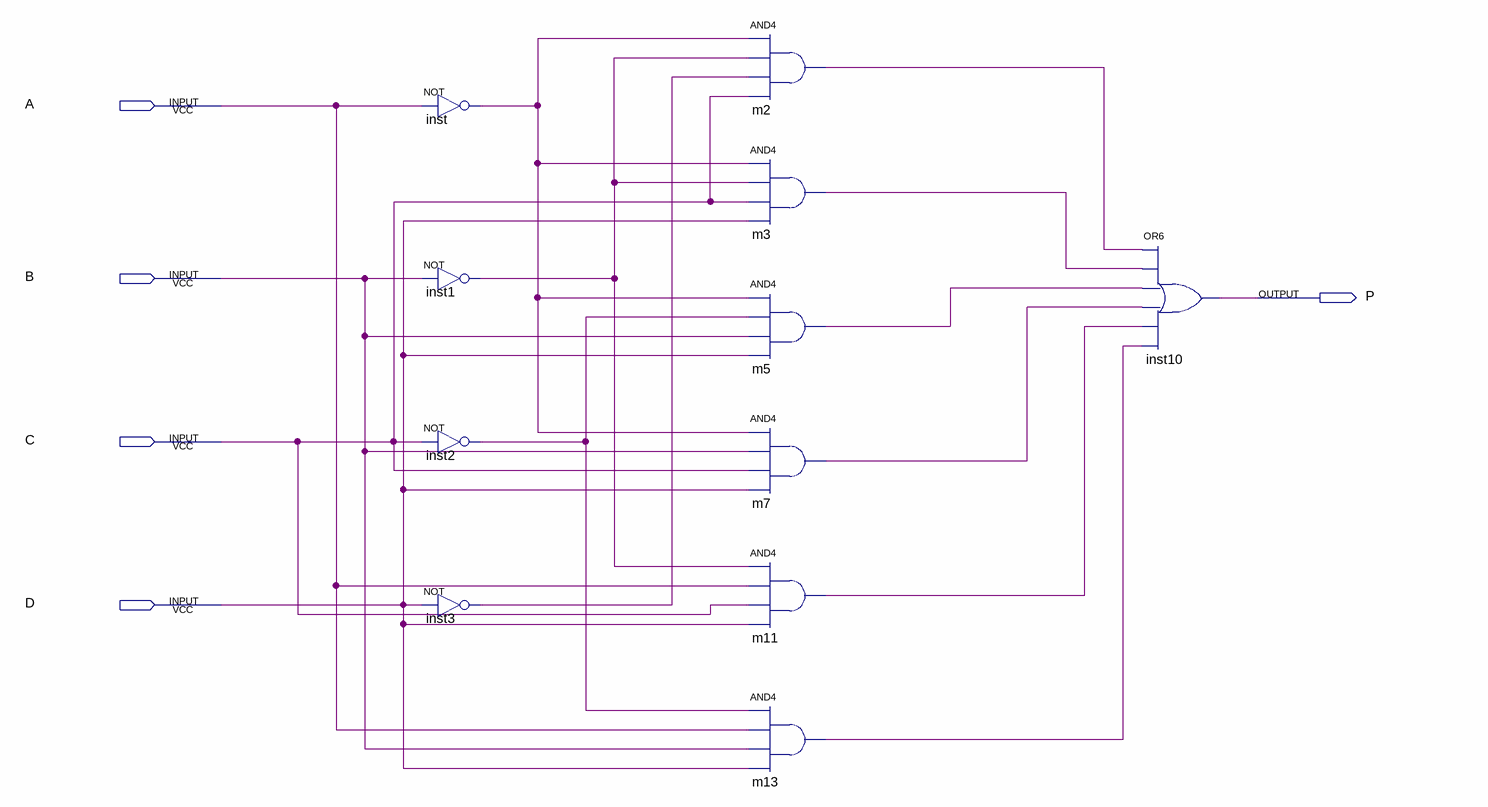
[diagram p0: schematic sheet]
// Quartus schematic P_SOP.bdf as structural Verilog: 11 symbols, 5 pins
module P_SOP (
  input  A,
  input  B,
  input  C,
  input  D,
  output P
);

  wire inst1_out, inst2_out, inst3_out, inst_out, m2_out, m3_out, m5_out, m7_out, m11_out, m13_out;

  not inst (inst_out, A);
  not inst1 (inst1_out, B);
  not inst2 (inst2_out, C);
  not inst3 (inst3_out, D);
  and m2 (m2_out, inst_out, inst1_out, inst3_out, C);
  and m3 (m3_out, inst_out, inst1_out, C, D);
  and m5 (m5_out, inst_out, inst2_out, B, D);
  and m7 (m7_out, inst_out, B, C, D);
  and m11 (m11_out, inst1_out, A, C, D);
  and m13 (m13_out, inst2_out, A, B, D);
  or inst10 (P, m2_out, m3_out, m5_out, m7_out, m11_out, m13_out);
endmodule
